# EAGLE schematic lines (EAGLE 7.4.0)
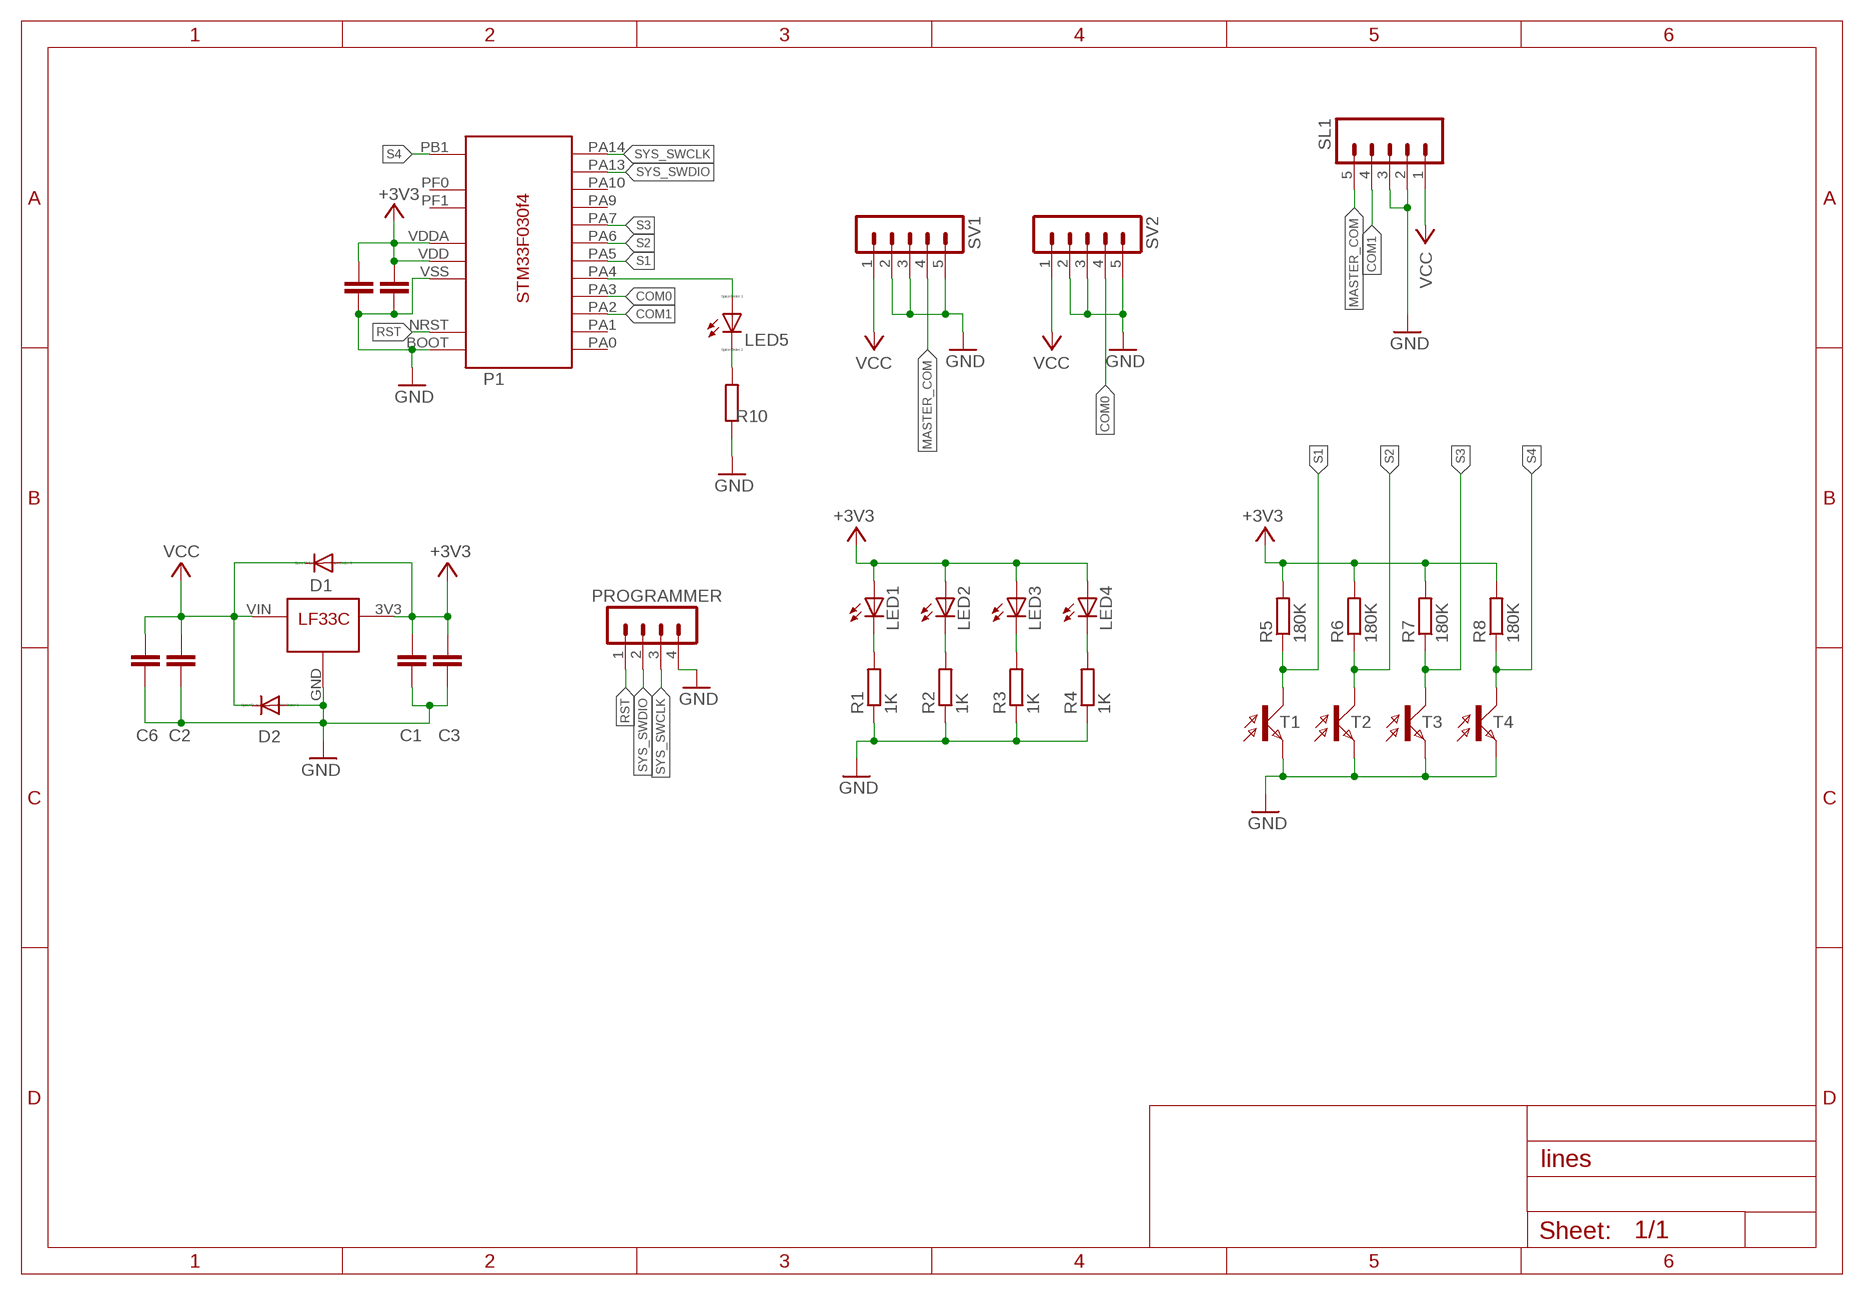
[diagram p0: schematic, sheet 1]

## Parts
C1  100k  C-EUC0603  [C0603]
C2  100k  C-EUC0603  [C0603]
C3  10u  C-EUC1206  [C1206]
C4  100K  C-EUC0603  [C0603]
C5  100K  C-EUC0603  [C0603]
C6  10u  C-EUC1206  [C1206]
D1  DIODE-MINIMELF  [MINIMELF]
D2  DIODE-MINIMELF  [MINIMELF]
LED1  LED5MM  [LED5MM]
LED2  LED5MM  [LED5MM]
LED3  LED5MM  [LED5MM]
LED4  LED5MM  [LED5MM]
LED5  LED_E  [LED_1206]
P1  STM32F030F4  [STM32F030F4]
PROGRAMMER  MA04-1  [MA04-1]
R1  1K  R-EU_R0603  [R0603]
R2  1K  R-EU_R0603  [R0603]
R3  1K  R-EU_R0603  [R0603]
R4  1K  R-EU_R0603  [R0603]
R5  180K  R-EU_R0603  [R0603]
R6  180K  R-EU_R0603  [R0603]
R7  180K  R-EU_R0603  [R0603]
R8  180K  R-EU_R0603  [R0603]
R10  R-EU_R0603  [R0603]
SL1  M05  [05P]
SV1  MA05-1  [MA05-1]
SV2  MA05-1  [MA05-1]
T1  BPX81  [BPX81]
T2  BPX81  [BPX81]
T3  BPX81  [BPX81]
T4  BPX81  [BPX81]
U$1  LF33C  [LF33C]

## Nets
+3V3: C1.1 C3.1 C4.1 C5.1 D1.A LED1.A LED2.A LED3.A LED4.A P1.VDD P1.VDDA R5.2 R6.2 R7.2 R8.2 U$1.3V3
COM0: P1.PA3 SV2.4
COM1: P1.PA2 SL1.4
GND: C1.2 C2.2 C3.2 C4.2 C5.2 C6.2 D2.A P1.BOOT P1.VSS PROGRAMMER.4 R1.1 R2.1 R3.1 R4.1 R10.1 SL1.2 SL1.3 SV1.2 SV1.3 SV1.5 SV2.2 SV2.3 SV2.5 T1.E T2.E T3.E T4.E U$1.GND
MASTER_COM: SL1.5 SV1.4
N$1: LED1.K(C) R1.2
N$2: LED2.K(C) R2.2
N$3: LED3.K(C) R3.2
N$4: LED4.K(C) R4.2
N$12: LED5.C R10.2
N$13: LED5.A P1.PA4
RST: P1.NRST PROGRAMMER.1
S1: P1.PA5 R5.1 T1.C
S2: P1.PA6 R6.1 T2.C
S3: P1.PA7 R7.1 T3.C
S4: P1.PB1 R8.1 T4.C
SYS_SWCLK: P1.PA14 PROGRAMMER.3
SYS_SWDIO: P1.PA13 PROGRAMMER.2
VCC: C2.1 C6.1 D1.C D2.C SL1.1 SV1.1 SV2.1 U$1.VIN
Unconnected: P1.PA0 P1.PA1 P1.PA9 P1.PA10 P1.PF0 P1.PF1

## Library data of the parts
C1-C6 = rcl:C-EU: CAPACITOR, European symbol
D1 D2 = diode:DIODE-: DIODE
LED1-LED4 = led:LED: LED OSRAM: - CHIPLED LG R971, LG N971, LY N971, LG Q971, LY Q971, LO R971, LY R971 LH N974, LH R974 LS Q976, LO Q976, LY Q976 LO Q996 - Hyper CHIPLED LW Q18S LB Q993, LB Q99A, LB R99A - SideLED LS A670, LO A670, LY A670, LG A670, LP A670 LB A673, LV A673, LT A673, LW A673 LH A674 LY A675 LS A676, LA A676, LO A676, LY A676, LW A676 LS A679, LY A679, LG A679 - Hyper Micro SIDELED® LS Y876, LA Y876, LO Y876, LY Y876 LT Y87S - SmartLED LW L88C, LW L88S LB L89C, LB L89S, LG L890 LS L89K, LO L89K, LY L89K LS L896, LA L896, LO L896, LY L896 - TOPLED LS T670, LO T670, LY T670, LG T670, LP T670 LSG T670, LSP T670, LSY T670, LOP T670, LYG T670 LG T671, LOG T671, LSG T671 LB T673, LV T673, LT T673, LW T673 LH T674 LS T676, LA T676, LO T676, LY T676, LB T676, LH T676, LSB T676, LW T676 LB T67C, LV T67C, LT T67C, LS T67K, LO T67K, LY T67K, LW E67C LS E67B, LA E67B, LO E67B, LY E67B, LB E67C, LV E67C, LT E67C LW T67C LS T679, LY T679, LG T679 LS T770, LO T770, LY T770, LG T770, LP T770 LB T773, LV T773, LT T773, LW T773 LH T774 LS E675, LA E675, LY E675, LS T675 LS T776, LA T776, LO T776, LY T776, LB T776 LHGB T686 LT T68C, LB T68C - Hyper Mini TOPLED® LB M676 - Mini TOPLED Santana® LG M470 LS M47K, LO M47K, LY M47K Source: http://www.osram.convergy.de LUXEON: - LUMILED® LXK2-PW12-R00, LXK2-PW12-S00, LXK2-PW14-U00, LXK2-PW14-V00 LXK2-PM12-R00, LXK2-PM12-S00, LXK2-PM14-U00 LXK2-PE12-Q00, LXK2-PE12-R00, LXK2-PE12-S00, LXK2-PE14-T00, LXK2-PE14-U00 LXK2-PB12-K00, LXK2-PB12-L00, LXK2-PB12-M00, LXK2-PB14-N00, LXK2-PB14-P00, LXK2-PB14-Q00 LXK2-PR12-L00, LXK2-PR12-M00, LXK2-PR14-Q00, LXK2-PR14-R00 LXK2-PD12-Q00, LXK2-PD12-R00, LXK2-PD12-S00 LXK2-PH12-R00, LXK2-PH12-S00 LXK2-PL12-P00, LXK2-PL12-Q00, LXK2-PL12-R00 Source: www.luxeon.com KINGBRIGHT: KA-3528ASYC Source: www.kingbright.com
LED5 = eagle-ltspice:LED_E: LED Source: http://www.osram.convergy.de Source: www.luxeon.com Source: www.kingbright.com; SPICEMODEL: NONE; SPICEPREFIX: D; SPICETYPE: diode
P1 = stm32f030f4:STM32F030F4
PROGRAMMER = con-lstb:MA04-1: PIN HEADER; OC_FARNELL: unknown; OC_NEWARK: unknown
R1-R8 R10 = rcl:R-EU_: RESISTOR, European symbol
SL1 = con-amp-quick:M05: AMP QUICK CONNECTOR; OC_FARNELL: unknown; OC_NEWARK: unknown
SV1 SV2 = con-lstb:MA05-1: PIN HEADER; OC_FARNELL: unknown; OC_NEWARK: unknown
T1-T4 = opto-trans-siemens:BPX81: PHOTO TRANSISTOR; OC_FARNELL: unknown; OC_NEWARK: unknown
U$1 = regulator:LF33C